# Altium schematic sheet v1.0.SchDoc
size 60 x 55 mm; PageSetup: Record=PageOptions|CenterHorizontal=True|CenterVertical=True|PrintScale=0.71|XCorrection=1.00|YCorrection=1.00|PrintKind=2|BorderSize=5000000|LeftOffset=0|BottomOffset=0|Orientation=2|PaperLength=1000|PaperWidth=1000|Scale=100|PaperSource=7|PrintQuality=-3|MediaType=1|DitherType=10|PrintScaleMode=1|PaperKind=A4|PaperIndex=9
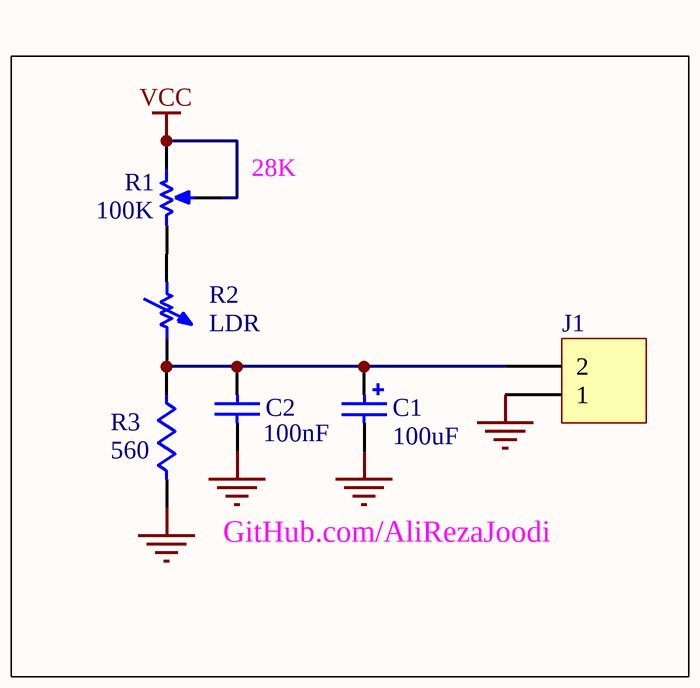
[diagram p0: v1.0.SchDoc]

## Parts
C1  value 100uF  [CAPPR2.5-6.3x5]  (hidden comment: Cap Pol1)
C2  value 100nF  [CAPNTO2.54-3.05x1.78A]  (hidden comment: Cap)
J1  Header  [Fonics_2PIN_1]  (value not drawn)
R1  value 100K  [VR4_]  (hidden comment: R15)
R2  value LDR  [Fonics_2PIN_1]  (hidden comment: Res Adj1)
R3  value 560  [AXIAL-0.4]  (hidden comment: Res1)

## Nets
GND: C1.2 C2.1 J1.1 R3.2
VCC: R1.1(TOP) R1.3(TAP)
NetC1_1: C1.1 C2.2 J1.2 R2.2 R3.1
NetR1_2: R1.2(BOT) R2.1

## Notes on the sheet
- (near R1) 28K
- GitHub.com/AliRezaJoodi

## Library data of the parts
C1 = Cap Pol1: Polarized Capacitor (Radial); Manufacturer: Generic Components; Class I: Passive; Published: 8-Jun-2000; Revision: July-2002: Re-released for DXP Platform.; Publisher: Altium Limited; Class II: Capacitor
C2 = Cap: Capacitor; Manufacturer: Generic Components; Class I: Passive; Published: 8-Jun-2000; Revision: July-2002: Re-released for DXP Platform.; Publisher: Altium Limited; Class II: Capacitor
J1 = Header 2: Header, 2-Pin; LatestRevisionDate: 17-Jul-2002; LatestRevisionNote: Re-released for DXP Platform.; Publisher: Altium Limited
R1 = RPot1: Potentiometer; Manufacturer: Generic Components; Class I: Passive; Set Position: 0.5; Published: 8-Jun-2000; Revision: July-2002: Re-released for DXP Platform.; Publisher: Altium Limited; Class II: Potentiometer
R2 = Res Adj1: Variable Resistor; Manufacturer: Generic Components; Class I: Passive; Set Position: 0.5; Published: 8-Jun-2000; Revision: July-2002: Re-released for DXP Platform.; Publisher: Altium Limited; Class II: Resistor
R3 = Res1: Resistor; Manufacturer: Generic Components; Class I: Passive; Published: 8-Jun-2000; Revision: July-2002: Re-released for DXP Platform.; Publisher: Altium Limited; Class II: Resistor